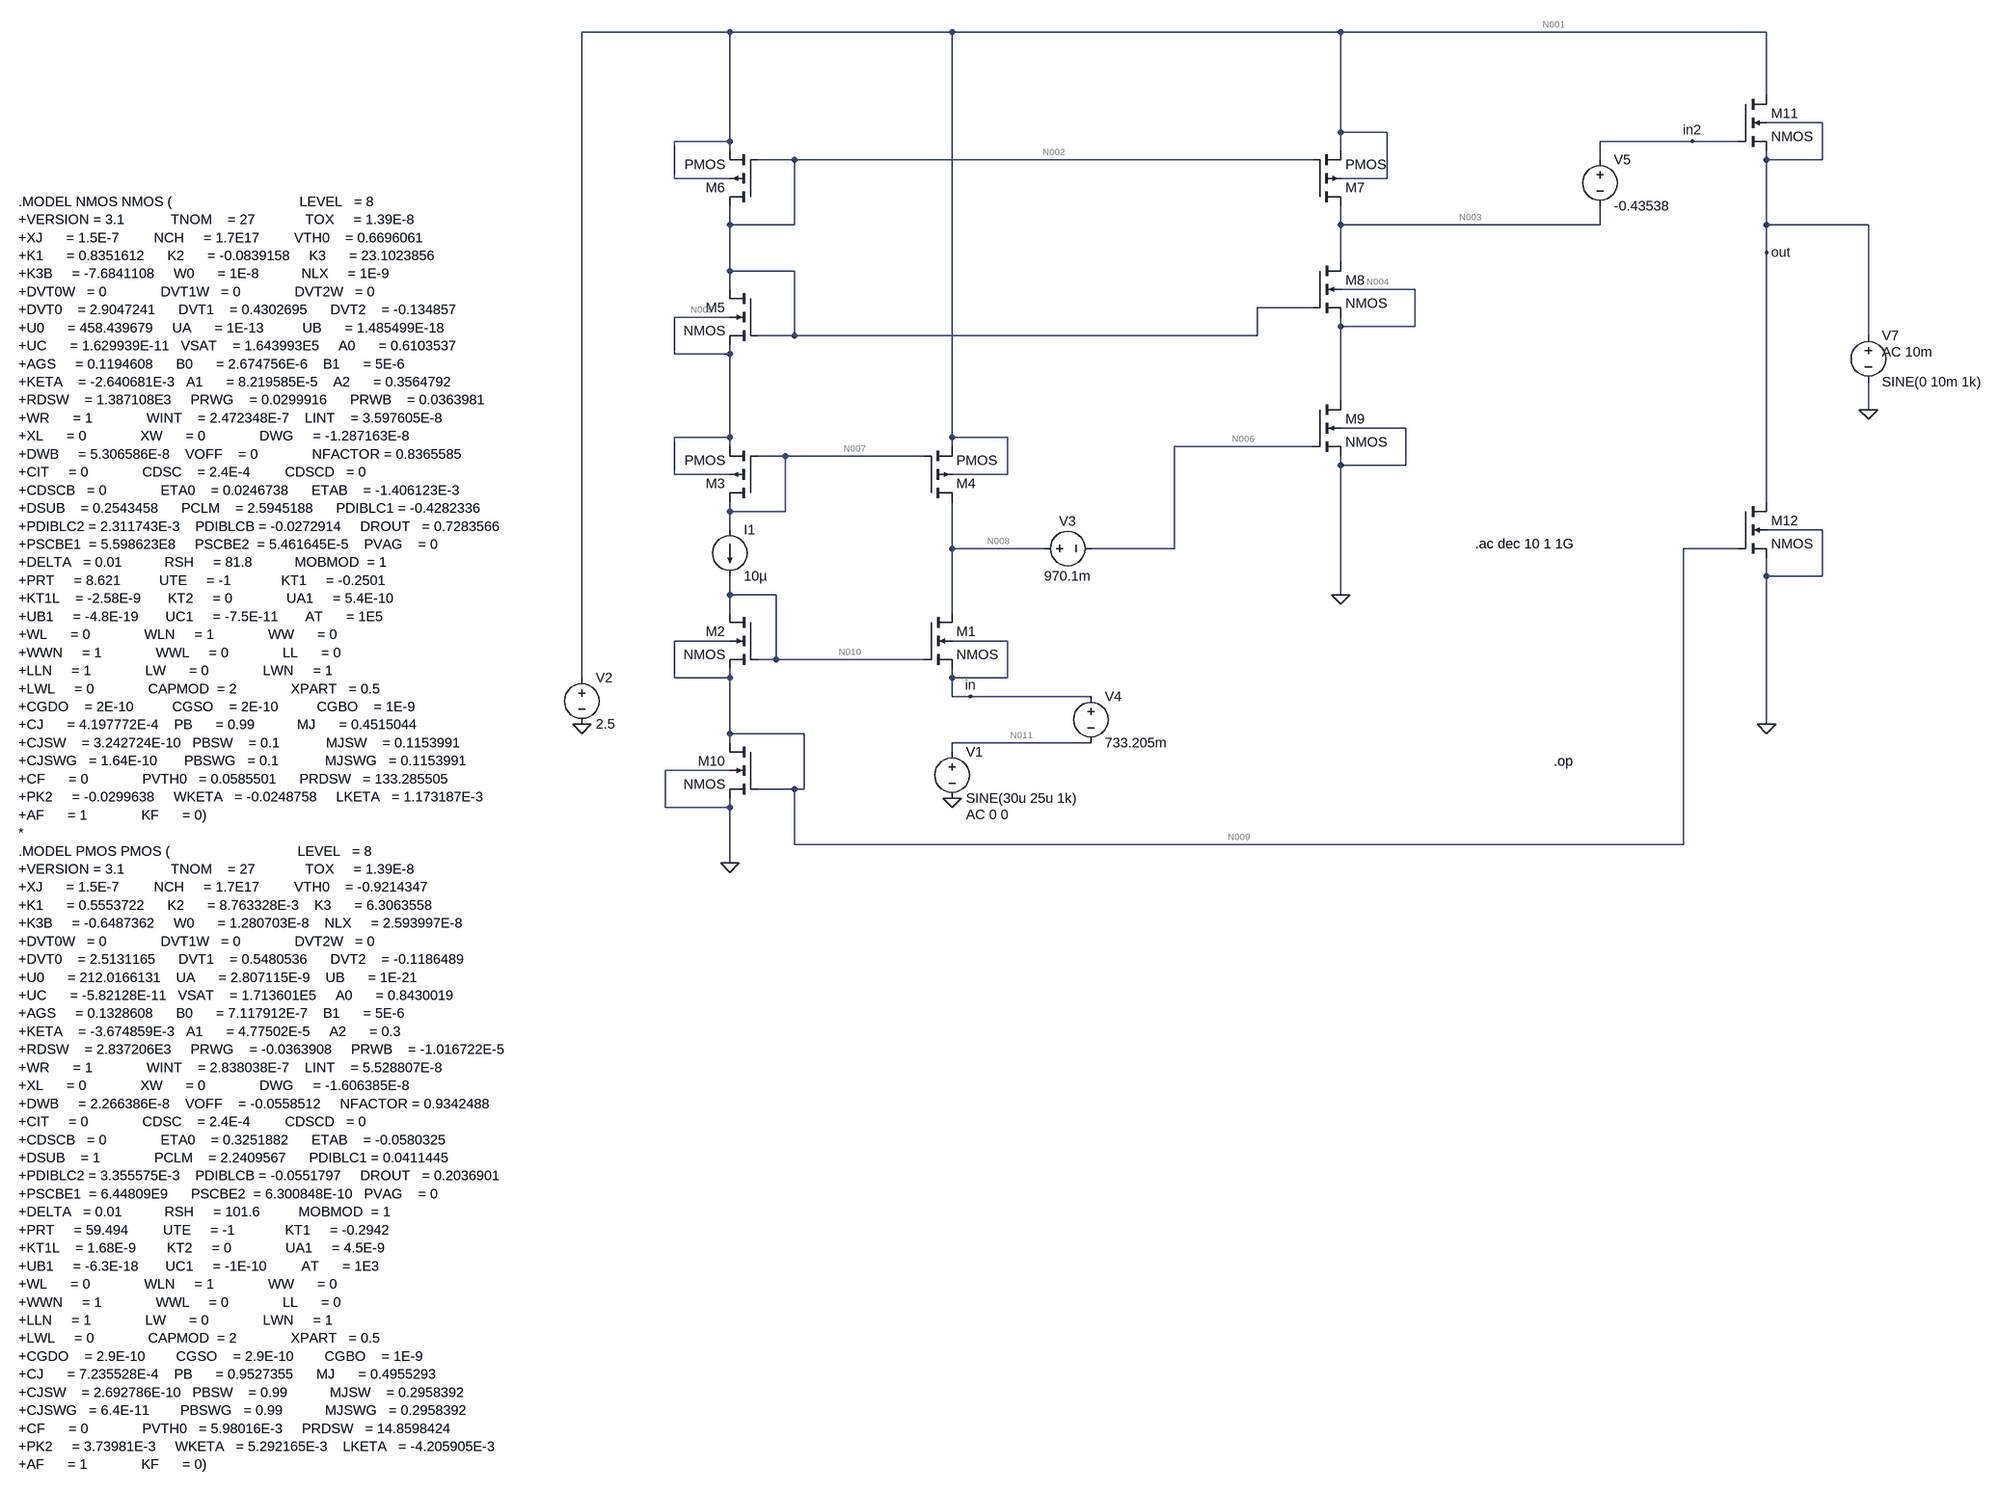
[diagram p0: schematic Rout.asc]
Rout.asc, the LTspice schematic file:
Version 4
SHEET 1 2356 1336
WIRE -96 -1136 -352 -1136
WIRE 288 -1136 -96 -1136
WIRE 960 -1136 288 -1136
WIRE 1696 -1136 960 -1136
WIRE 1696 -1024 1696 -1136
WIRE 1792 -976 1696 -976
WIRE 960 -960 960 -1136
WIRE 1040 -960 960 -960
WIRE -96 -944 -96 -1136
WIRE -96 -944 -192 -944
WIRE 1568 -944 1408 -944
WIRE 1648 -944 1568 -944
WIRE -96 -928 -96 -944
WIRE 960 -928 960 -960
WIRE 16 -912 -48 -912
WIRE 912 -912 16 -912
WIRE 1408 -912 1408 -944
WIRE 1696 -912 1696 -928
WIRE 1792 -912 1792 -976
WIRE 1792 -912 1696 -912
WIRE -192 -880 -192 -944
WIRE -96 -880 -192 -880
WIRE 1040 -880 1040 -960
WIRE 1040 -880 960 -880
WIRE -96 -800 -96 -832
WIRE 16 -800 16 -912
WIRE 16 -800 -96 -800
WIRE 960 -800 960 -832
WIRE 1408 -800 1408 -832
WIRE 1408 -800 960 -800
WIRE 1696 -800 1696 -912
WIRE 1872 -800 1696 -800
WIRE 1696 -752 1696 -800
WIRE 960 -736 960 -800
WIRE -96 -720 -96 -800
WIRE 16 -720 -96 -720
WIRE -96 -688 -96 -720
WIRE 1088 -688 960 -688
WIRE 912 -656 816 -656
WIRE -96 -640 -192 -640
WIRE 960 -624 960 -640
WIRE 1088 -624 1088 -688
WIRE 1088 -624 960 -624
WIRE 16 -608 16 -720
WIRE 16 -608 -48 -608
WIRE 816 -608 816 -656
WIRE 816 -608 16 -608
WIRE 1872 -608 1872 -800
WIRE -192 -576 -192 -640
WIRE -96 -576 -96 -592
WIRE -96 -576 -192 -576
WIRE 960 -496 960 -624
WIRE 1872 -480 1872 -528
WIRE 1072 -448 960 -448
WIRE -96 -432 -96 -576
WIRE -96 -432 -192 -432
WIRE 288 -432 288 -1136
WIRE 384 -432 288 -432
WIRE -96 -416 -96 -432
WIRE 288 -416 288 -432
WIRE 912 -416 672 -416
WIRE 0 -400 -48 -400
WIRE 240 -400 0 -400
WIRE 960 -384 960 -400
WIRE 1072 -384 1072 -448
WIRE 1072 -384 960 -384
WIRE -192 -368 -192 -432
WIRE -96 -368 -192 -368
WIRE 384 -368 384 -432
WIRE 384 -368 288 -368
WIRE 1696 -320 1696 -752
WIRE -96 -304 -96 -320
WIRE 0 -304 0 -400
WIRE 0 -304 -96 -304
WIRE -96 -272 -96 -304
WIRE 1792 -272 1696 -272
WIRE 288 -240 288 -320
WIRE 448 -240 288 -240
WIRE 672 -240 672 -416
WIRE 672 -240 528 -240
WIRE 1648 -240 1552 -240
WIRE 1696 -192 1696 -224
WIRE 1792 -192 1792 -272
WIRE 1792 -192 1696 -192
WIRE -96 -160 -96 -192
WIRE -16 -160 -96 -160
WIRE 960 -160 960 -384
WIRE -96 -128 -96 -160
WIRE 288 -128 288 -240
WIRE -96 -80 -192 -80
WIRE 384 -80 288 -80
WIRE -16 -48 -16 -160
WIRE -16 -48 -48 -48
WIRE 240 -48 -16 -48
WIRE -352 -16 -352 -1136
WIRE -192 -16 -192 -80
WIRE -96 -16 -96 -32
WIRE -96 -16 -192 -16
WIRE 288 -16 288 -32
WIRE 384 -16 384 -80
WIRE 384 -16 288 -16
WIRE 288 16 288 -16
WIRE 320 16 288 16
WIRE 528 16 320 16
WIRE 1696 64 1696 -192
WIRE -96 80 -96 -16
WIRE 32 80 -96 80
WIRE -96 96 -96 80
WIRE 528 96 288 96
WIRE 288 112 288 96
WIRE -96 144 -208 144
WIRE 16 176 -48 176
WIRE 32 176 32 80
WIRE 32 176 16 176
WIRE -208 208 -208 144
WIRE -96 208 -96 192
WIRE -96 208 -208 208
WIRE 16 272 16 176
WIRE 1552 272 1552 -240
WIRE 1552 272 16 272
WIRE -96 304 -96 208
FLAG 288 192 0
FLAG -352 64 0
FLAG 960 -160 0
FLAG 1696 64 0
FLAG -96 304 0
FLAG 320 16 in
FLAG 1696 -752 out
FLAG 1568 -944 in2
FLAG 1872 -480 0
SYMBOL nmos4 240 -128 R0
SYMATTR InstName M1
SYMATTR Value2 l=200u w=5.342u
SYMBOL nmos4 -48 -128 M0
SYMATTR InstName M2
SYMATTR Value2 l=200u w=534.2u
SYMBOL pmos4 -48 -320 R180
SYMATTR InstName M3
SYMATTR Value2 l=5000u w=300u
SYMBOL pmos4 240 -320 M180
SYMATTR InstName M4
SYMATTR Value2 l=5000u w=3u
SYMBOL current -96 -272 R0
WINDOW 123 0 0 Left 0
WINDOW 39 0 0 Left 0
SYMATTR InstName I1
SYMATTR Value 10µ
SYMBOL voltage -352 -32 R0
WINDOW 123 0 0 Left 0
WINDOW 39 0 0 Left 0
SYMATTR InstName V2
SYMATTR Value 2.5
SYMBOL voltage 288 96 R0
WINDOW 123 24 124 Left 2
WINDOW 39 0 0 Left 0
SYMATTR Value2 AC 0 0
SYMATTR InstName V1
SYMATTR Value SINE(30u 25u 1k)
SYMBOL nmos4 -48 -688 M0
SYMATTR InstName M5
SYMATTR Value2 l=20u w=91.7353u
SYMBOL pmos4 -48 -832 R180
SYMATTR InstName M6
SYMATTR Value2 l=20u w=292.6u
SYMBOL pmos4 912 -832 M180
SYMATTR InstName M7
SYMATTR Value2 l=20u w=29.26u
SYMBOL nmos4 912 -736 R0
SYMATTR InstName M8
SYMATTR Value2 l=20u w=19.69230769u
SYMBOL nmos4 912 -496 R0
SYMATTR InstName M9
SYMATTR Value2 l=20u w=377u
SYMBOL voltage 432 -240 R270
WINDOW 0 32 56 VTop 2
WINDOW 3 -32 56 VBottom 2
WINDOW 123 0 0 Left 0
WINDOW 39 0 0 Left 0
SYMATTR InstName V3
SYMATTR Value 970.1m
SYMBOL nmos4 -48 96 M0
SYMATTR InstName M10
SYMATTR Value2 l=200u w=21367.5u
SYMBOL nmos4 1648 -1024 R0
SYMATTR InstName M11
SYMATTR Value2 l=200u w=21.3675u
SYMBOL nmos4 1648 -320 R0
SYMATTR InstName M12
SYMATTR Value2 l=200u w=21.3675u
SYMBOL voltage 528 0 R0
WINDOW 123 0 0 Left 0
WINDOW 39 0 0 Left 0
SYMATTR InstName V4
SYMATTR Value 733.205m
SYMBOL voltage 1408 -928 R0
WINDOW 123 0 0 Left 0
WINDOW 39 0 0 Left 0
SYMATTR InstName V5
SYMATTR Value -0.43538
SYMBOL voltage 1872 -624 R0
WINDOW 123 24 44 Left 2
WINDOW 39 0 0 Left 0
SYMATTR Value2 AC 10m
SYMATTR InstName V7
SYMATTR Value SINE(0 10m 1k)
TEXT -3976 -840 Left 2 !.MODEL NMOS NMOS (                                 LEVEL   = 8\n+VERSION = 3.1            TNOM    = 27             TOX     = 1.39E-8\n+XJ      = 1.5E-7         NCH     = 1.7E17         VTH0    = 0.6696061\n+K1      = 0.8351612      K2      = -0.0839158     K3      = 23.1023856\n+K3B     = -7.6841108     W0      = 1E-8           NLX     = 1E-9\n+DVT0W   = 0              DVT1W   = 0              DVT2W   = 0\n+DVT0    = 2.9047241      DVT1    = 0.4302695      DVT2    = -0.134857\n+U0      = 458.439679     UA      = 1E-13          UB      = 1.485499E-18\n+UC      = 1.629939E-11   VSAT    = 1.643993E5     A0      = 0.6103537\n+AGS     = 0.1194608      B0      = 2.674756E-6    B1      = 5E-6\n+KETA    = -2.640681E-3   A1      = 8.219585E-5    A2      = 0.3564792\n+RDSW    = 1.387108E3     PRWG    = 0.0299916      PRWB    = 0.0363981\n+WR      = 1              WINT    = 2.472348E-7    LINT    = 3.597605E-8\n+XL      = 0              XW      = 0              DWG     = -1.287163E-8\n+DWB     = 5.306586E-8    VOFF    = 0              NFACTOR = 0.8365585\n+CIT     = 0              CDSC    = 2.4E-4         CDSCD   = 0\n+CDSCB   = 0              ETA0    = 0.0246738      ETAB    = -1.406123E-3\n+DSUB    = 0.2543458      PCLM    = 2.5945188      PDIBLC1 = -0.4282336\n+PDIBLC2 = 2.311743E-3    PDIBLCB = -0.0272914     DROUT   = 0.7283566\n+PSCBE1  = 5.598623E8     PSCBE2  = 5.461645E-5    PVAG    = 0\n+DELTA   = 0.01           RSH     = 81.8           MOBMOD  = 1\n+PRT     = 8.621          UTE     = -1             KT1     = -0.2501\n+KT1L    = -2.58E-9       KT2     = 0              UA1     = 5.4E-10\n+UB1     = -4.8E-19       UC1     = -7.5E-11       AT      = 1E5\n+WL      = 0              WLN     = 1              WW      = 0\n+WWN     = 1              WWL     = 0              LL      = 0\n+LLN     = 1              LW      = 0              LWN     = 1\n+LWL     = 0              CAPMOD  = 2              XPART   = 0.5\n+CGDO    = 2E-10          CGSO    = 2E-10          CGBO    = 1E-9\n+CJ      = 4.197772E-4    PB      = 0.99           MJ      = 0.4515044\n+CJSW    = 3.242724E-10   PBSW    = 0.1            MJSW    = 0.1153991\n+CJSWG   = 1.64E-10       PBSWG   = 0.1            MJSWG   = 0.1153991\n+CF      = 0              PVTH0   = 0.0585501      PRDSW   = 133.285505\n+PK2     = -0.0299638     WKETA   = -0.0248758     LKETA   = 1.173187E-3\n+AF      = 1              KF      = 0)\n*\n.MODEL PMOS PMOS (                                 LEVEL   = 8\n+VERSION = 3.1            TNOM    = 27             TOX     = 1.39E-8\n+XJ      = 1.5E-7         NCH     = 1.7E17         VTH0    = -0.9214347\n+K1      = 0.5553722      K2      = 8.763328E-3    K3      = 6.3063558\n+K3B     = -0.6487362     W0      = 1.280703E-8    NLX     = 2.593997E-8\n+DVT0W   = 0              DVT1W   = 0              DVT2W   = 0\n+DVT0    = 2.5131165      DVT1    = 0.5480536      DVT2    = -0.1186489\n+U0      = 212.0166131    UA      = 2.807115E-9    UB      = 1E-21\n+UC      = -5.82128E-11   VSAT    = 1.713601E5     A0      = 0.8430019\n+AGS     = 0.1328608      B0      = 7.117912E-7    B1      = 5E-6\n+KETA    = -3.674859E-3   A1      = 4.77502E-5     A2      = 0.3\n+RDSW    = 2.837206E3     PRWG    = -0.0363908     PRWB    = -1.016722E-5\n+WR      = 1              WINT    = 2.838038E-7    LINT    = 5.528807E-8\n+XL      = 0              XW      = 0              DWG     = -1.606385E-8\n+DWB     = 2.266386E-8    VOFF    = -0.0558512     NFACTOR = 0.9342488\n+CIT     = 0              CDSC    = 2.4E-4         CDSCD   = 0\n+CDSCB   = 0              ETA0    = 0.3251882      ETAB    = -0.0580325\n+DSUB    = 1              PCLM    = 2.2409567      PDIBLC1 = 0.0411445\n+PDIBLC2 = 3.355575E-3    PDIBLCB = -0.0551797     DROUT   = 0.2036901\n+PSCBE1  = 6.44809E9      PSCBE2  = 6.300848E-10   PVAG    = 0\n+DELTA   = 0.01           RSH     = 101.6          MOBMOD  = 1\n+PRT     = 59.494         UTE     = -1             KT1     = -0.2942\n+KT1L    = 1.68E-9        KT2     = 0              UA1     = 4.5E-9\n+UB1     = -6.3E-18       UC1     = -1E-10         AT      = 1E3\n+WL      = 0              WLN     = 1              WW      = 0\n+WWN     = 1              WWL     = 0              LL      = 0\n+LLN     = 1              LW      = 0              LWN     = 1\n+LWL     = 0              CAPMOD  = 2              XPART   = 0.5\n+CGDO    = 2.9E-10        CGSO    = 2.9E-10        CGBO    = 1E-9\n+CJ      = 7.235528E-4    PB      = 0.9527355      MJ      = 0.4955293\n+CJSW    = 2.692786E-10   PBSW    = 0.99           MJSW    = 0.2958392\n+CJSWG   = 6.4E-11        PBSWG   = 0.99           MJSWG   = 0.2958392\n+CF      = 0              PVTH0   = 5.98016E-3     PRDSW   = 14.8598424\n+PK2     = 3.73981E-3     WKETA   = 5.292165E-3    LKETA   = -4.205905E-3 \n+AF      = 1              KF      = 0)
TEXT 1328 128 Left 2 !.op
TEXT 1192 -248 Left 2 !.ac dec 10 1 1G

The netlist it stands for:
* Rout.asc
M1 N008 N010 in in NMOS l=200u w=5.342u
M2 N010 N010 N009 N009 NMOS l=200u w=534.2u
M3 N007 N007 N005 N005 PMOS l=5000u w=300u
M4 N008 N007 N001 N001 PMOS l=5000u w=3u
I1 N007 N010 10µ
V2 N001 0 2.5
V1 N011 0 SINE(30u 25u 1k) AC 0 0
M5 N002 N002 N005 N005 NMOS l=20u w=91.7353u
M6 N002 N002 N001 N001 PMOS l=20u w=292.6u
M7 N003 N002 N001 N001 PMOS l=20u w=29.26u
M8 N003 N002 N004 N004 NMOS l=20u w=19.69230769u
M9 N004 N006 0 0 NMOS l=20u w=377u
V3 N008 N006 970.1m
M10 N009 N009 0 0 NMOS l=200u w=21367.5u
M11 N001 in2 out out NMOS l=200u w=21.3675u
M12 out N009 0 0 NMOS l=200u w=21.3675u
V4 in N011 733.205m
V5 in2 N003 -0.43538
V7 out 0 SINE(0 10m 1k) AC 10m
.model NMOS NMOS
.model PMOS PMOS
.lib standard.mos
.MODEL NMOS NMOS (                                 LEVEL   = 8
+VERSION = 3.1            TNOM    = 27             TOX     = 1.39E-8
+XJ      = 1.5E-7         NCH     = 1.7E17         VTH0    = 0.6696061
+K1      = 0.8351612      K2      = -0.0839158     K3      = 23.1023856
+K3B     = -7.6841108     W0      = 1E-8           NLX     = 1E-9
+DVT0W   = 0              DVT1W   = 0              DVT2W   = 0
+DVT0    = 2.9047241      DVT1    = 0.4302695      DVT2    = -0.134857
+U0      = 458.439679     UA      = 1E-13          UB      = 1.485499E-18
+UC      = 1.629939E-11   VSAT    = 1.643993E5     A0      = 0.6103537
+AGS     = 0.1194608      B0      = 2.674756E-6    B1      = 5E-6
+KETA    = -2.640681E-3   A1      = 8.219585E-5    A2      = 0.3564792
+RDSW    = 1.387108E3     PRWG    = 0.0299916      PRWB    = 0.0363981
+WR      = 1              WINT    = 2.472348E-7    LINT    = 3.597605E-8
+XL      = 0              XW      = 0              DWG     = -1.287163E-8
+DWB     = 5.306586E-8    VOFF    = 0              NFACTOR = 0.8365585
+CIT     = 0              CDSC    = 2.4E-4         CDSCD   = 0
+CDSCB   = 0              ETA0    = 0.0246738      ETAB    = -1.406123E-3
+DSUB    = 0.2543458      PCLM    = 2.5945188      PDIBLC1 = -0.4282336
+PDIBLC2 = 2.311743E-3    PDIBLCB = -0.0272914     DROUT   = 0.7283566
+PSCBE1  = 5.598623E8     PSCBE2  = 5.461645E-5    PVAG    = 0
+DELTA   = 0.01           RSH     = 81.8           MOBMOD  = 1
+PRT     = 8.621          UTE     = -1             KT1     = -0.2501
+KT1L    = -2.58E-9       KT2     = 0              UA1     = 5.4E-10
+UB1     = -4.8E-19       UC1     = -7.5E-11       AT      = 1E5
+WL      = 0              WLN     = 1              WW      = 0
+WWN     = 1              WWL     = 0              LL      = 0
+LLN     = 1              LW      = 0              LWN     = 1
+LWL     = 0              CAPMOD  = 2              XPART   = 0.5
+CGDO    = 2E-10          CGSO    = 2E-10          CGBO    = 1E-9
+CJ      = 4.197772E-4    PB      = 0.99           MJ      = 0.4515044
+CJSW    = 3.242724E-10   PBSW    = 0.1            MJSW    = 0.1153991
+CJSWG   = 1.64E-10       PBSWG   = 0.1            MJSWG   = 0.1153991
+CF      = 0              PVTH0   = 0.0585501      PRDSW   = 133.285505
+PK2     = -0.0299638     WKETA   = -0.0248758     LKETA   = 1.173187E-3
+AF      = 1              KF      = 0)
*
.MODEL PMOS PMOS (                                 LEVEL   = 8
+VERSION = 3.1            TNOM    = 27             TOX     = 1.39E-8
+XJ      = 1.5E-7         NCH     = 1.7E17         VTH0    = -0.9214347
+K1      = 0.5553722      K2      = 8.763328E-3    K3      = 6.3063558
+K3B     = -0.6487362     W0      = 1.280703E-8    NLX     = 2.593997E-8
+DVT0W   = 0              DVT1W   = 0              DVT2W   = 0
+DVT0    = 2.5131165      DVT1    = 0.5480536      DVT2    = -0.1186489
+U0      = 212.0166131    UA      = 2.807115E-9    UB      = 1E-21
+UC      = -5.82128E-11   VSAT    = 1.713601E5     A0      = 0.8430019
+AGS     = 0.1328608      B0      = 7.117912E-7    B1      = 5E-6
+KETA    = -3.674859E-3   A1      = 4.77502E-5     A2      = 0.3
+RDSW    = 2.837206E3     PRWG    = -0.0363908     PRWB    = -1.016722E-5
+WR      = 1              WINT    = 2.838038E-7    LINT    = 5.528807E-8
+XL      = 0              XW      = 0              DWG     = -1.606385E-8
+DWB     = 2.266386E-8    VOFF    = -0.0558512     NFACTOR = 0.9342488
+CIT     = 0              CDSC    = 2.4E-4         CDSCD   = 0
+CDSCB   = 0              ETA0    = 0.3251882      ETAB    = -0.0580325
+DSUB    = 1              PCLM    = 2.2409567      PDIBLC1 = 0.0411445
+PDIBLC2 = 3.355575E-3    PDIBLCB = -0.0551797     DROUT   = 0.2036901
+PSCBE1  = 6.44809E9      PSCBE2  = 6.300848E-10   PVAG    = 0
+DELTA   = 0.01           RSH     = 101.6          MOBMOD  = 1
+PRT     = 59.494         UTE     = -1             KT1     = -0.2942
+KT1L    = 1.68E-9        KT2     = 0              UA1     = 4.5E-9
+UB1     = -6.3E-18       UC1     = -1E-10         AT      = 1E3
+WL      = 0              WLN     = 1              WW      = 0
+WWN     = 1              WWL     = 0              LL      = 0
+LLN     = 1              LW      = 0              LWN     = 1
+LWL     = 0              CAPMOD  = 2              XPART   = 0.5
+CGDO    = 2.9E-10        CGSO    = 2.9E-10        CGBO    = 1E-9
+CJ      = 7.235528E-4    PB      = 0.9527355      MJ      = 0.4955293
+CJSW    = 2.692786E-10   PBSW    = 0.99           MJSW    = 0.2958392
+CJSWG   = 6.4E-11        PBSWG   = 0.99           MJSWG   = 0.2958392
+CF      = 0              PVTH0   = 5.98016E-3     PRDSW   = 14.8598424
+PK2     = 3.73981E-3     WKETA   = 5.292165E-3    LKETA   = -4.205905E-3
+AF      = 1              KF      = 0)
.op
.ac dec 10 1 1G
.backanno
.end

* Results of the author's LTspice run, read from the files saved beside the schematic
* Operating Point, zero values left out:
*   V(n008) = 1.678 V
*   V(n010) = 1.697 V
*   V(in) = 733.2 mV
*   V(n009) = 733.4 mV
*   V(n007) = -4.352 V
*   V(n005) = 465.4 mV
*   V(n001) = 2.5 V
*   V(n011) = 30 µV
*   V(n002) = 1.377 V
*   V(n003) = 1.245 V
*   V(n004) = 510.3 mV
*   V(n006) = 707.5 mV
*   V(in2) = 810 mV
*   Id(M7) = -956.5 nA
*   Ib(M7) = 1.265 pA
*   Is(M7) = 956.5 nA
*   Id(M6) = -10 µA
*   Ib(M6) = 1.133 pA
*   Is(M6) = 10 µA
*   Id(M4) = -48.03 nA
*   Is(M4) = 48.03 nA
*   Id(M3) = -10 µA
*   Ib(M3) = 4.828 pA
*   Is(M3) = 10 µA
*   Id(M11) = 38.17 nA
*   Ib(M11) = -2.51 pA
*   Is(M11) = -38.16 nA
*   Id(M10) = 10 µA
*   Is(M10) = -10 µA
*   Id(M9) = 956.5 nA
*   Is(M9) = -956.5 nA
*   Id(M8) = 956.5 nA
*   Is(M8) = -956.5 nA
*   Id(M5) = 10 µA
*   Is(M5) = -10 µA
*   Id(M2) = 10 µA
*   Is(M2) = -10 µA
*   Id(M1) = 48.03 nA
*   Is(M1) = -48.03 nA
*   I(I1) = 10 µA
*   I(V7) = 38.17 nA
*   I(V4) = 48.03 nA
*   I(V1) = 48.03 nA
*   I(V2) = -11.04 µA
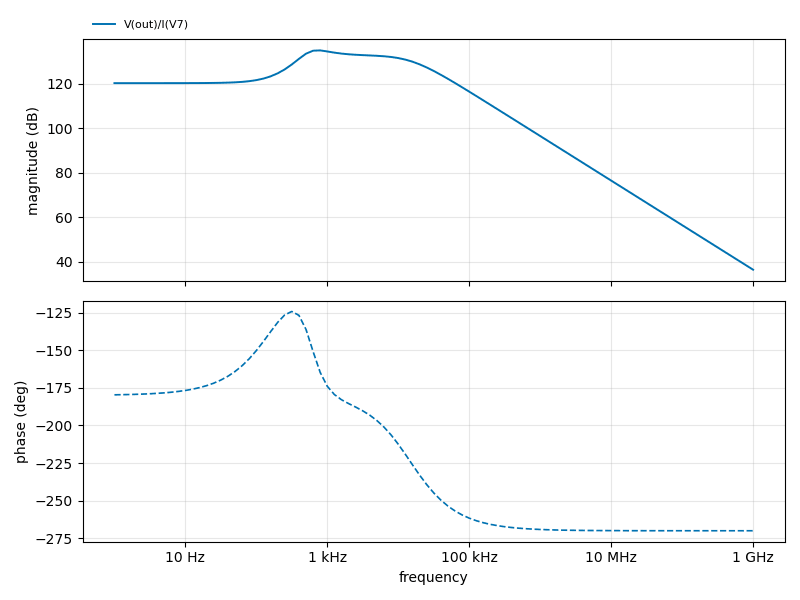
[diagram p1: AC Analysis of Rout.asc, plotted from the saved traces]
* AC Analysis, 1 run:
*   V(out)/I(V7): 120.17 dB at 1 Hz, 36.44 dB at 1 GHz, peak 134.86 dB at 794.3 Hz, 3 dB below the peak at 430 Hz and 8.155 kHz
* From the log:
*   Semiconductor Device Operating Points:
*                           --- BSIM3 MOSFETS ---
*   Name:        m7          m6          m4          m3          m12
*   Model:      pmos        pmos        pmos        pmos        nmos
*   Id:        -9.57e-7    -1.00e-5    -4.80e-8    -1.00e-5     0.00e+0
*   Vgs:       -1.12e+0    -1.12e+0    -6.85e+0    -4.82e+0     7.33e-1
*   Vds:       -1.25e+0    -1.12e+0    -8.22e-1    -4.82e+0     0.00e+0
*   Vbs:        0.00e+0     0.00e+0     0.00e+0     0.00e+0     0.00e+0
*   Vth:       -9.24e-1    -9.22e-1    -9.52e-1    -9.22e-1     6.83e-1
*   Vdsat:     -1.89e-1    -1.92e-1    -5.49e+0    -3.51e+0     5.53e-2
*   Gm:         9.65e-6     9.97e-5     5.76e-9     4.47e-6     0.00e+0
*   Gds:        9.87e-9     1.04e-7     5.37e-8     1.20e-9     2.13e-7
*   Gmb         2.86e-6     2.96e-5     5.05e-9     1.40e-6     0.00e+0
*   Cbd:        0.00e+0     0.00e+0     0.00e+0     0.00e+0     0.00e+0
*   Cbs:        0.00e+0     0.00e+0     0.00e+0     0.00e+0     0.00e+0
*   Cgsov:       NaN         NaN         NaN         NaN         NaN
*   Cgdov:       NaN         NaN         NaN         NaN         NaN
*   Cgbov:       NaN         NaN         NaN         NaN         NaN
*   dQgdVgb:     NaN         NaN         NaN        2.74e-9      NaN
*   dQgdVdb:     NaN         NaN         NaN         NaN         NaN
*   dQgdVsb:     NaN         NaN         NaN       -2.93e-9      NaN
*   dQddVgb:     NaN         NaN         NaN       -1.24e-9      NaN
*   dQddVdb:     NaN         NaN         NaN         NaN         NaN
*   dQddVsb:     NaN         NaN         NaN        1.63e-9      NaN
*   dQbdVgb:     NaN         NaN         NaN         NaN         NaN
*   dQbdVdb:     NaN         NaN         NaN         NaN         NaN
*   dQbdVsb:     NaN         NaN         NaN         NaN         NaN
*   Name:        m11         m10         m9          m8          m5
*   Model:      nmos        nmos        nmos        nmos        nmos
*   Id:         3.82e-8     1.00e-5     9.57e-7     9.57e-7     1.00e-5
*   Vgs:        8.10e-1     7.33e-1     7.07e-1     8.67e-1     9.12e-1
*   Vds:        2.50e+0     7.33e-1     5.10e-1     7.35e-1     9.12e-1
*   Vbs:        0.00e+0     0.00e+0     0.00e+0     0.00e+0     0.00e+0
*   Vth:        6.83e-1     6.70e-1     6.70e-1     6.84e-1     6.73e-1
*   Vdsat:      9.22e-2     6.16e-2     5.35e-2     1.36e-1     1.94e-1
*   Gm:         7.68e-7     2.31e-4     2.25e-5     1.50e-5     1.14e-4
*   Gds:         NaN        4.07e-8     2.48e-8     1.61e-8     1.37e-7
*   Gmb         2.71e-7     8.28e-5     8.16e-6     5.22e-6     3.91e-5
*   Cbd:        0.00e+0     0.00e+0     0.00e+0     0.00e+0     0.00e+0
*   Cbs:        0.00e+0     0.00e+0     0.00e+0     0.00e+0     0.00e+0
*   Cgsov:       NaN         NaN         NaN         NaN         NaN
*   Cgdov:       NaN         NaN         NaN         NaN         NaN
*   Cgbov:       NaN         NaN         NaN         NaN         NaN
*   dQgdVgb:     NaN        7.24e-9      NaN         NaN         NaN
*   dQgdVdb:     NaN         NaN         NaN         NaN         NaN
*   dQgdVsb:     NaN       -5.34e-9      NaN         NaN         NaN
*   dQddVgb:     NaN       -3.01e-9      NaN         NaN         NaN
*   dQddVdb:     NaN         NaN         NaN         NaN         NaN
*   dQddVsb:     NaN        4.13e-9      NaN         NaN         NaN
*   dQbdVgb:     NaN       -1.23e-9      NaN         NaN         NaN
*   dQbdVdb:     NaN         NaN         NaN         NaN         NaN
*   dQbdVsb:     NaN       -2.91e-9      NaN         NaN         NaN
*   Name:        m2          m1
*   Model:      nmos        nmos
*   Id:         1.00e-5     4.80e-8
*   Vgs:        9.64e-1     9.64e-1
*   Vds:        9.64e-1     9.44e-1
*   Vbs:        0.00e+0     0.00e+0
*   Vth:        6.70e-1     7.25e-1
*   Vdsat:      2.51e-1     1.79e-1
*   Gm:         8.47e-5     5.53e-7
*   Gds:        3.43e-8      NaN
*   Gmb         2.88e-5     1.97e-7
*   Cbd:        0.00e+0     0.00e+0
*   Cbs:        0.00e+0     0.00e+0
*   Cgsov:       NaN         NaN
*   Cgdov:       NaN         NaN
*   Cgbov:       NaN         NaN
*   dQgdVgb:     NaN         NaN
*   dQgdVdb:     NaN         NaN
*   dQgdVsb:     NaN         NaN
*   dQddVgb:     NaN         NaN
*   dQddVdb:     NaN         NaN
*   dQddVsb:     NaN         NaN
*   dQbdVgb:     NaN         NaN
*   dQbdVdb:     NaN         NaN
*   dQbdVsb:     NaN         NaN